# Altium schematic sheet Connectors.SchDoc
size A
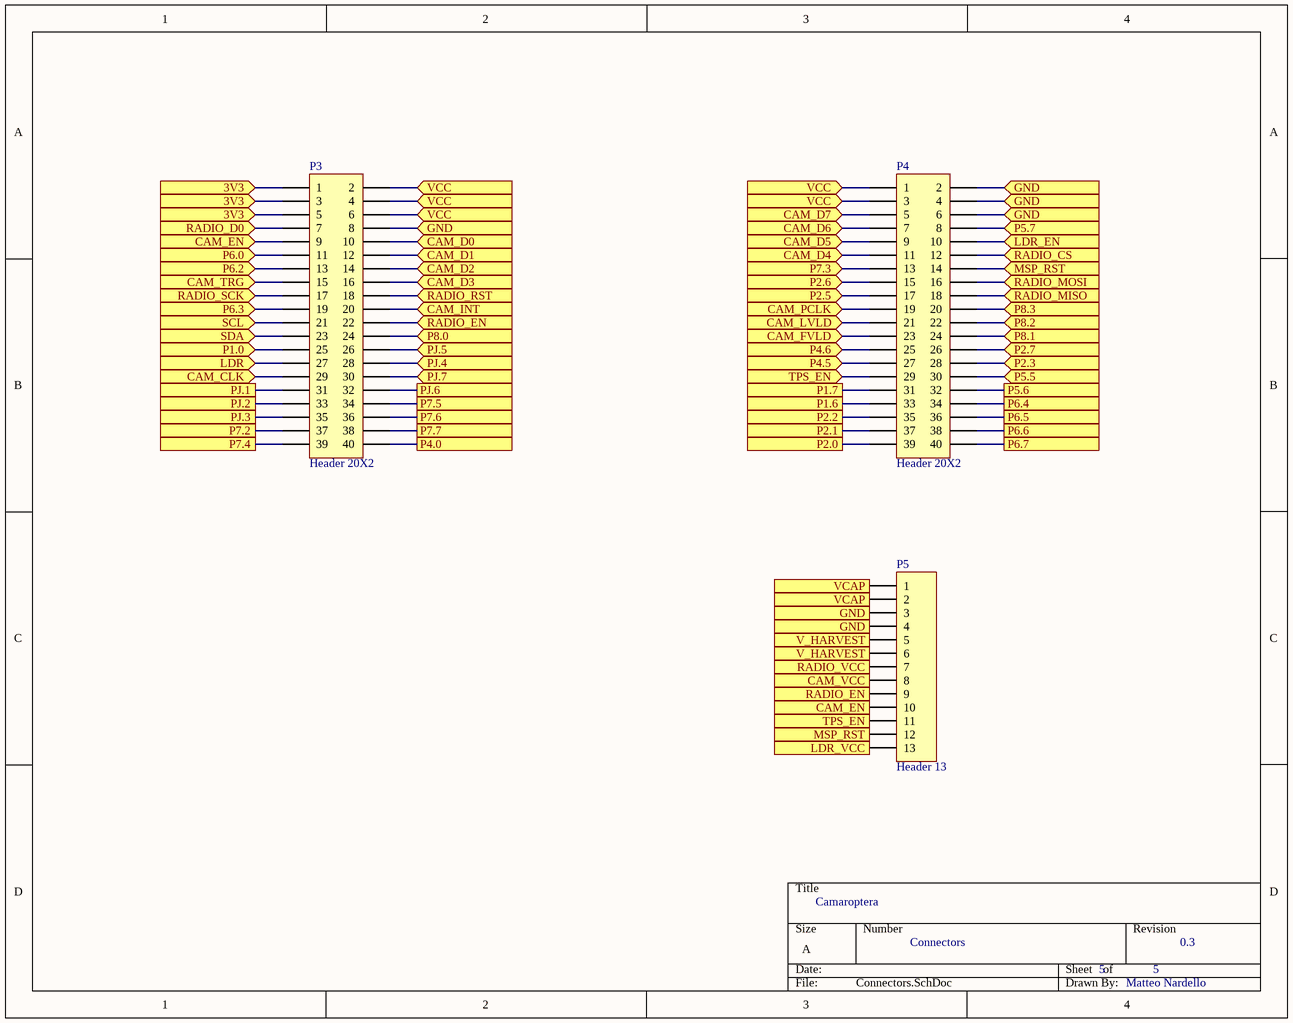
[diagram p0: Connectors.SchDoc]

## Parts
P3  Header 20X2  [HDR2X20]
P4  Header 20X2  [HDR2X20]
P5  Header 13  [HDR1X13]

## Ports
3V3 (in), CAM_CLK (in), CAM_D0 (in), CAM_D1 (in), CAM_D2 (in), CAM_D3 (in), CAM_D4 (in), CAM_D5 (in), CAM_D6 (in), CAM_D7 (in), CAM_EN (in), CAM_EN (out), CAM_FVLD (in), CAM_INT (in), CAM_LVLD (in), CAM_PCLK (in), CAM_TRG (in), CAM_VCC (out), GND (in), GND (out), LDR (in), LDR_EN (in), LDR_VCC (in), MSP_RST (in), MSP_RST (out), P1.0 (in), P1.6, P1.7, P2.0, P2.1, P2.2, P2.3 (in), P2.5 (in), P2.6 (in), P2.7 (in), P4.0, P4.5 (in), P4.6 (in), P5.5 (in), P5.6, P5.7 (in), P6.0 (in), P6.2 (in), P6.3 (in), P6.4, P6.5, P6.6, P6.7, P7.2, P7.3 (in), P7.4, P7.5, P7.6, P7.7, P8.0 (in), P8.1 (in), P8.2 (in), P8.3 (in), PJ.1, PJ.2, PJ.3, PJ.4 (in), PJ.5 (in), PJ.6, PJ.7 (in), RADIO_CS (in), RADIO_D0 (in), RADIO_EN (in), RADIO_EN (out), RADIO_MISO (in), RADIO_MOSI (in), RADIO_RST (in), RADIO_SCK (in), RADIO_VCC (out), SCL (in), SDA (in), TPS_EN (in), TPS_EN (out), V_HARVEST (in), V_HARVEST (out), VCAP (in), VCAP (out), VCC (in)

## Nets
3V3: P3.1 P3.3 P3.5 ; port 3V3
CAM_CLK: P3.29 ; port CAM_CLK
CAM_D0: P3.10 ; port CAM_D0
CAM_D1: P3.12 ; port CAM_D1
CAM_D2: P3.14 ; port CAM_D2
CAM_D3: P3.16 ; port CAM_D3
CAM_D4: P4.11 ; port CAM_D4
CAM_D5: P4.9 ; port CAM_D5
CAM_D6: P4.7 ; port CAM_D6
CAM_D7: P4.5 ; port CAM_D7
CAM_EN: P3.9 P5.10 ; port CAM_EN
CAM_FVLD: P4.23 ; port CAM_FVLD
CAM_INT: P3.20 ; port CAM_INT
CAM_LVLD: P4.21 ; port CAM_LVLD
CAM_PCLK: P4.19 ; port CAM_PCLK
CAM_TRG: P3.15 ; port CAM_TRG
CAM_VCC: P5.8 ; port CAM_VCC
GND: P3.8 P4.2 P4.4 P4.6 P5.3 P5.4 ; port GND
LDR: P3.27 ; port LDR
LDR_EN: P4.10 ; port LDR_EN
LDR_VCC: P5.13 ; port LDR_VCC
MSP_RST: P4.14 P5.12 ; port MSP_RST
P1.0: P3.25 ; port P1.0
P1.6: P4.33 ; port P1.6
P1.7: P4.31 ; port P1.7
P2.0: P4.39 ; port P2.0
P2.1: P4.37 ; port P2.1
P2.2: P4.35 ; port P2.2
P2.3: P4.28 ; port P2.3
P2.5: P4.17 ; port P2.5
P2.6: P4.15 ; port P2.6
P2.7: P4.26 ; port P2.7
P4.0: P3.40 ; port P4.0
P4.5: P4.27 ; port P4.5
P4.6: P4.25 ; port P4.6
P5.5: P4.30 ; port P5.5
P5.6: P4.32 ; port P5.6
P5.7: P4.8 ; port P5.7
P6.0: P3.11 ; port P6.0
P6.2: P3.13 ; port P6.2
P6.3: P3.19 ; port P6.3
P6.4: P4.34 ; port P6.4
P6.5: P4.36 ; port P6.5
P6.6: P4.38 ; port P6.6
P6.7: P4.40 ; port P6.7
P7.2: P3.37 ; port P7.2
P7.3: P4.13 ; port P7.3
P7.4: P3.39 ; port P7.4
P7.5: P3.34 ; port P7.5
P7.6: P3.36 ; port P7.6
P7.7: P3.38 ; port P7.7
P8.0: P3.24 ; port P8.0
P8.1: P4.24 ; port P8.1
P8.2: P4.22 ; port P8.2
P8.3: P4.20 ; port P8.3
PJ.1: P3.31 ; port PJ.1
PJ.2: P3.33 ; port PJ.2
PJ.3: P3.35 ; port PJ.3
PJ.4: P3.28 ; port PJ.4
PJ.5: P3.26 ; port PJ.5
PJ.6: P3.32 ; port PJ.6
PJ.7: P3.30 ; port PJ.7
RADIO_CS: P4.12 ; port RADIO_CS
RADIO_D0: P3.7 ; port RADIO_D0
RADIO_EN: P3.22 P5.9 ; port RADIO_EN
RADIO_MISO: P4.18 ; port RADIO_MISO
RADIO_MOSI: P4.16 ; port RADIO_MOSI
RADIO_RST: P3.18 ; port RADIO_RST
RADIO_SCK: P3.17 ; port RADIO_SCK
RADIO_VCC: P5.7 ; port RADIO_VCC
SCL: P3.21 ; port SCL
SDA: P3.23 ; port SDA
TPS_EN: P4.29 P5.11 ; port TPS_EN
V_HARVEST: P5.5 P5.6 ; port V_HARVEST
VCAP: P5.1 P5.2 ; port VCAP
VCC: P3.2 P3.4 P3.6 P4.1 P4.3 ; port VCC

## Notes on the sheet
- Camaroptera
- Connectors
- 5
- 0.3
- Matteo Nardello

## Library data of the parts
P3 P4 = Header 20X2: Header, 20-Pin, Dual row; LatestRevisionDate: 17-Jul-2002; LatestRevisionNote: Re-released for DXP Platform.; Publisher: Altium Limited
P5 = Header 13: Header, 13-Pin; LatestRevisionDate: 17-Jul-2002; LatestRevisionNote: Re-released for DXP Platform.; Publisher: Altium Limited